# EAGLE schematic Basic Control Board (EAGLE 7.5.0)
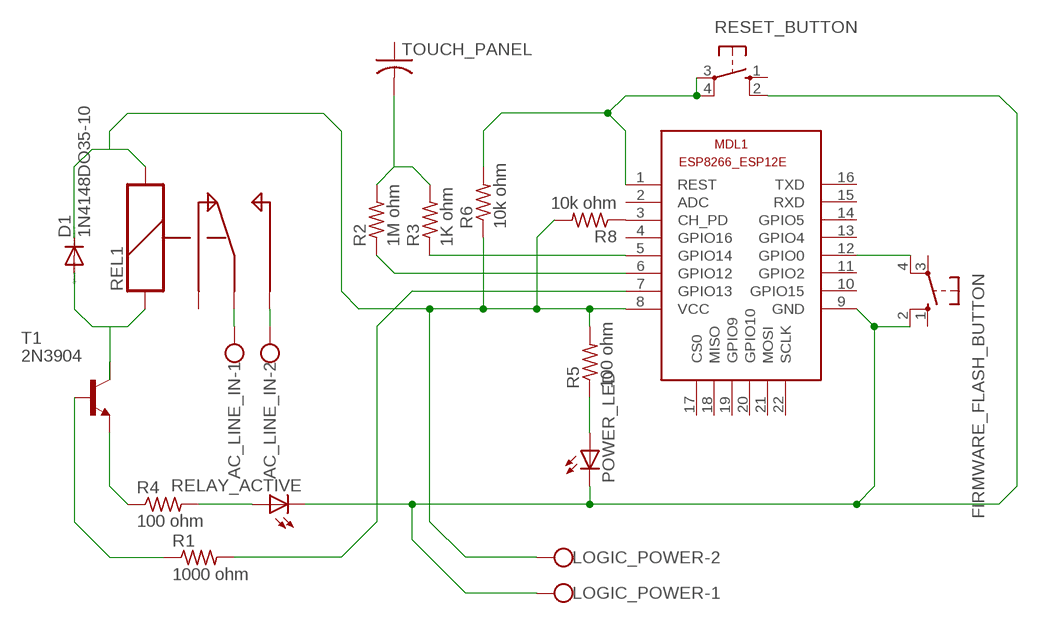
[diagram p0: schematic, sheet 1]

## Parts
AC_LINE_IN  W237-102  [W237-102]
D1  1N4148DO35-10  [DO35-10]
FIRMWARE_FLASH_BUTTON  10-XX  [B3F-10XX]
LOGIC_POWER  W237-102  [W237-102]
MDL1  ESP8266-12EESP8266-ESP12E  [ESP8266-ESP12E]
POWER_LED  LED5MM  [LED5MM]
R1  1000 ohm  R-US_0204/7  [0204/7]
R2  1M ohm  R-US_0204/7  [0204/7]
R3  1K ohm  R-US_0204/7  [0204/7]
R4  100 ohm  R-US_0204/7  [0204/7]
R5  100 ohm  R-US_0204/7  [0204/7]
R6  10k ohm  R-US_0204/7  [0204/7]
R8  10k ohm  R-US_0204/7  [0204/7]
REL1  REL-5PIN  [REL-5PIN]
RELAY_ACTIVE  LED5MM  [LED5MM]
RESET_BUTTON  10-XX  [B3F-10XX]
T1  2N3904  [TO92]
TOUCH_PANEL  C-US025-025X050  [C025-025X050]

## Nets
N$1: D1.C LOGIC_POWER.2 MDL1.8(VCC) R5.2 R6.1 R8.2 REL1.S2
N$2: D1.A REL1.S1 T1.1(C)
N$3: R4.1 T1.3(E)
N$4: MDL1.7(GPIO13) R1.2
N$5: R1.1 T1.2(B)
N$6: AC_LINE_IN.1 REL1.C
N$7: AC_LINE_IN.2 REL1.O
N$8: MDL1.6(GPIO12) R2.1
N$9: MDL1.5(GPIO14) R3.1
N$10: R2.2 R3.2 TOUCH_PANEL.2
N$11: FIRMWARE_FLASH_BUTTON.2(S1) LOGIC_POWER.1 MDL1.9(GND) POWER_LED.K(C) RELAY_ACTIVE.K(C) RESET_BUTTON.2(S1)
N$12: MDL1.1(REST) R6.2 RESET_BUTTON.3(P) RESET_BUTTON.4(P1)
N$13: R4.2 RELAY_ACTIVE.A
N$14: POWER_LED.A R5.1
N$15: FIRMWARE_FLASH_BUTTON.4(P1) MDL1.12(GPIO0)
N$17: MDL1.3(CH_PD) R8.1
Unconnected: FIRMWARE_FLASH_BUTTON.1(S) FIRMWARE_FLASH_BUTTON.3(P) MDL1.2(ADC) MDL1.4(GPIO16) MDL1.10(GPIO15) MDL1.11(GPIO2) MDL1.13(GPIO4) MDL1.14(GPIO5) MDL1.15(RXD) MDL1.16(TXD) MDL1.17(CS0) MDL1.18(MISO) MDL1.19(GPIO9) MDL1.20(GPIO10) MDL1.21(MOSI) MDL1.22(SCLK) REL1.S RESET_BUTTON.1(S) TOUCH_PANEL.1

## Library data of the parts
AC_LINE_IN LOGIC_POWER = con-wago-500:W237-102: WAGO SCREW CLAMP; MPN: 237-102; OC_FARNELL: unknown; OC_NEWARK: 70K9898
D1 = diode:1N4148: DIODE high speed (Philips)
FIRMWARE_FLASH_BUTTON RESET_BUTTON = switch-omron:10-XX: OMRON SWITCH; MPN: B3F-1000; OC_FARNELL: 176432; OC_NEWARK: 36M3542
MDL1 = ESP8266-ESP12E:ESP8266-12E: ESP8266-12E with additional I/O and GPIO04/05 corrected The author cannot warrant that this library is free from error or will meet your specific requirements. Created by PuceBaboon.com. Komagane, Nagano, JAPAN
POWER_LED RELAY_ACTIVE = led:LED: LED OSRAM: - CHIPLED LG R971, LG N971, LY N971, LG Q971, LY Q971, LO R971, LY R971 LH N974, LH R974 LS Q976, LO Q976, LY Q976 LO Q996 - Hyper CHIPLED LW Q18S LB Q993, LB Q99A, LB R99A - SideLED LS A670, LO A670, LY A670, LG A670, LP A670 LB A673, LV A673, LT A673, LW A673 LH A674 LY A675 LS A676, LA A676, LO A676, LY A676, LW A676 LS A679, LY A679, LG A679 - Hyper Micro SIDELED® LS Y876, LA Y876, LO Y876, LY Y876 LT Y87S - SmartLED LW L88C, LW L88S LB L89C, LB L89S, LG L890 LS L89K, LO L89K, LY L89K LS L896, LA L896, LO L896, LY L896 - TOPLED LS T670, LO T670, LY T670, LG T670, LP T670 LSG T670, LSP T670, LSY T670, LOP T670, LYG T670 LG T671, LOG T671, LSG T671 LB T673, LV T673, LT T673, LW T673 LH T674 LS T676, LA T676, LO T676, LY T676, LB T676, LH T676, LSB T676, LW T676 LB T67C, LV T67C, LT T67C, LS T67K, LO T67K, LY T67K, LW E67C LS E67B, LA E67B, LO E67B, LY E67B, LB E67C, LV E67C, LT E67C LW T67C LS T679, LY T679, LG T679 LS T770, LO T770, LY T770, LG T770, LP T770 LB T773, LV T773, LT T773, LW T773 LH T774 LS E675, LA E675, LY E675, LS T675 LS T776, LA T776, LO T776, LY T776, LB T776 LHGB T686 LT T68C, LB T68C - Hyper Mini TOPLED® LB M676 - Mini TOPLED Santana® LG M470 LS M47K, LO M47K, LY M47K Source: http://www.osram.convergy.de LUXEON: - LUMILED® LXK2-PW12-R00, LXK2-PW12-S00, LXK2-PW14-U00, LXK2-PW14-V00 LXK2-PM12-R00, LXK2-PM12-S00, LXK2-PM14-U00 LXK2-PE12-Q00, LXK2-PE12-R00, LXK2-PE12-S00, LXK2-PE14-T00, LXK2-PE14-U00 LXK2-PB12-K00, LXK2-PB12-L00, LXK2-PB12-M00, LXK2-PB14-N00, LXK2-PB14-P00, LXK2-PB14-Q00 LXK2-PR12-L00, LXK2-PR12-M00, LXK2-PR14-Q00, LXK2-PR14-R00 LXK2-PD12-Q00, LXK2-PD12-R00, LXK2-PD12-S00 LXK2-PH12-R00, LXK2-PH12-S00 LXK2-PL12-P00, LXK2-PL12-Q00, LXK2-PL12-R00 Source: www.luxeon.com KINGBRIGHT: KA-3528ASYC Source: www.kingbright.com
R1-R6 R8 = resistor:R-US_: RESISTOR, American symbol
REL1 = special:REL-5PIN: RELAY
T1 = transistor:2N3904: NPN TRANSISTOR
TOUCH_PANEL = resistor:C-US: CAPACITOR, American symbol

## Module RELAY
Ports: 

### Library data of the parts